# Altium schematic sheet Safety_2019_V_3_0_BSPD.SchDoc
size A
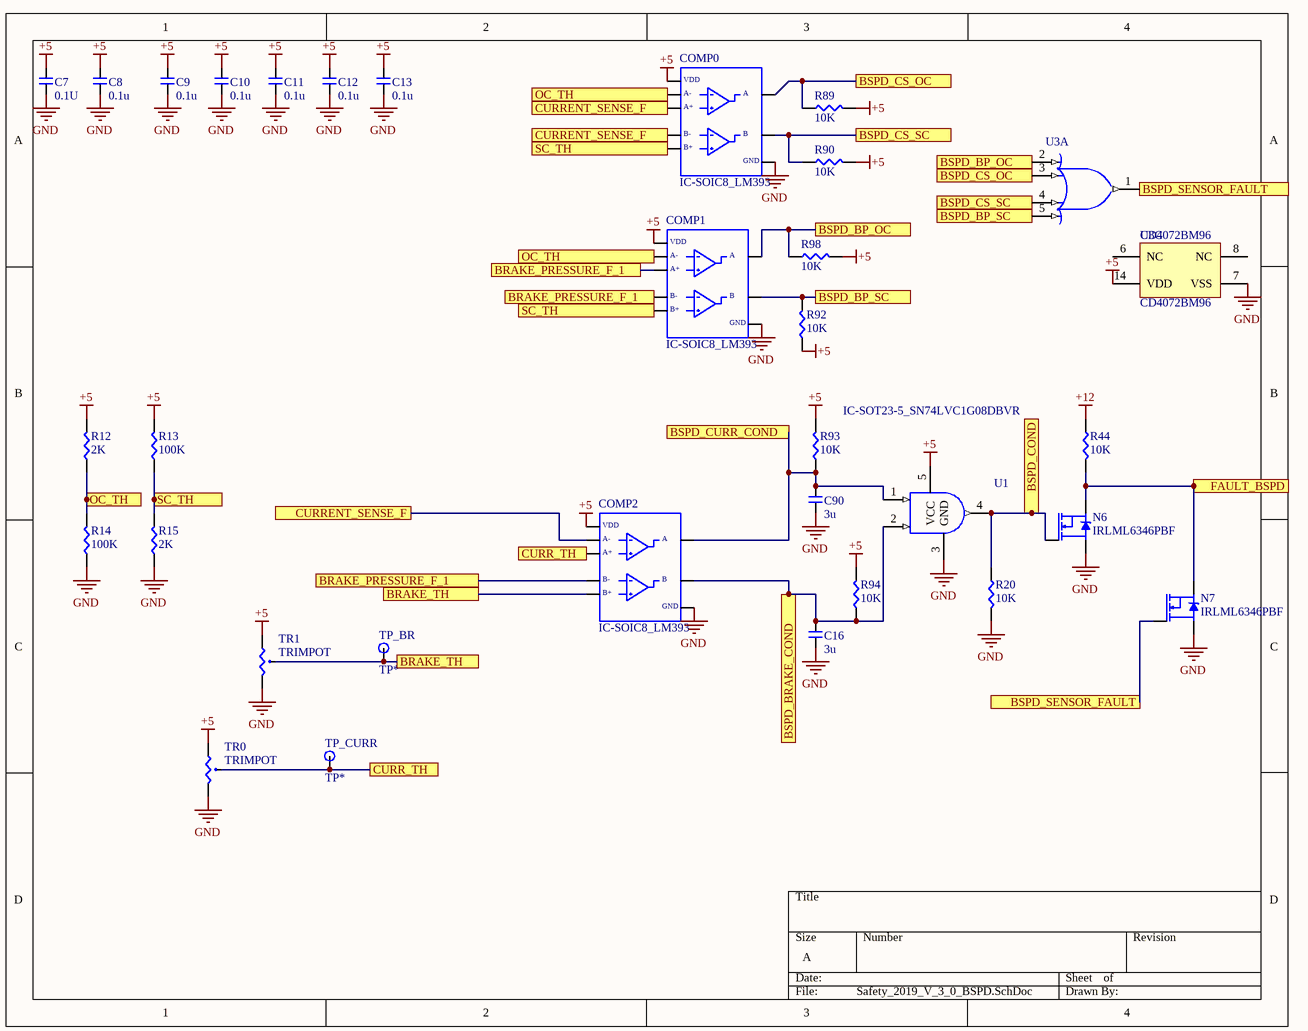
[diagram p0: Safety_2019_V_3_0_BSPD.SchDoc]

## Parts
C7  0.1U  [CAP-0603]
C8  0.1u  [CAP-0603]
C9  0.1u  [CAP-0603]
C10  0.1u  [CAP-0603]
C11  0.1u  [CAP-0603]
C12  0.1u  [CAP-0603]
C13  0.1u  [CAP-0603]
C16  3u  [CAP-0603]
C90  3u  [CAP-0603]
COMP0  IC-SOIC8_LM393  [SOIC8]
COMP1  IC-SOIC8_LM393  [SOIC8]
COMP2  IC-SOIC8_LM393  [SOIC8]
N6  IRLML6346PBF  [SOT23]
N7  IRLML6346PBF  [SOT23]
R12  2K  [RES-0603]
R13  100K  [RES-0603]
R14  100K  [RES-0603]
R15  2K  [RES-0603]
R20  10K  [RES-0603]
R44  10K  [RES-0603]
R89  10K  [RES-0603]
R90  10K  [RES-0603]
R92  10K  [RES-0603]
R93  10K  [RES-0603]
R94  10K  [RES-0603]
R98  10K  [RES-0603]
TP_BR  TP*  [Testpoint]
TP_CURR  TP*  [Testpoint]
TR0  TRIMPOT  [TRIMPOT_PV36W]
TR1  TRIMPOT  [TRIMPOT_PV36W]
U1  IC-SOT23-5_SN74LVC1G08DBVR  [SOT95P280X110-5N]
U3  CD4072BM96  [SOIC127P600X175-14N]  (parts A,C of 3)

## Ports
BRAKE_PRESSURE_F_1, BRAKE_TH, BSPD_BP_OC, BSPD_BP_SC, BSPD_BRAKE_COND, BSPD_COND, BSPD_CS_OC, BSPD_CS_SC, BSPD_CURR_COND, BSPD_SENSOR_FAULT, CURR_TH, CURRENT_SENSE_F, FAULT_BSPD, OC_TH, SC_TH

## Nets
+5: C7.2 C8.2 C9.2 C10.2 C11.2 C12.2 C13.2 COMP0.8 COMP1.8 COMP2.8 R12.2 R13.2 R89.2 R90.2 R92.1 R93.2 R94.2 R98.2 TR0.1 TR1.1 U1.5(VCC) U3.14(VDD)
+12: R44.1
GND: C7.1 C8.1 C9.1 C10.1 C11.1 C12.1 C13.1 C16.1 C90.1 COMP0.4 COMP1.4 COMP2.4 N6.2(S) N7.2(S) R14.1 R15.1 R20.2 TR0.3 TR1.3 U1.3(GND) U3.7(VSS)
BRAKE_PRESSURE_F_1: COMP1.3 COMP1.6 COMP2.6 ; port BRAKE_PRESSURE_F_1
BRAKE_TH: COMP2.5 TP_BR.1 TR1.2 ; port BRAKE_TH
BSPD_BP_OC: COMP1.1 R98.1 U3.2(A) ; port BSPD_BP_OC
BSPD_BP_SC: COMP1.7 R92.2 U3.5(D) ; port BSPD_BP_SC
BSPD_BRAKE_COND: C16.2 COMP2.7 R94.1 U1.2(B) ; port BSPD_BRAKE_COND
BSPD_COND: N6.1(G) R20.1 U1.4(Y) ; port BSPD_COND
BSPD_CS_OC: COMP0.1 R89.1 U3.3(B) ; port BSPD_CS_OC
BSPD_CS_SC: COMP0.7 R90.1 U3.4(C) ; port BSPD_CS_SC
BSPD_CURR_COND: C90.2 COMP2.1 R93.1 U1.1(A) ; port BSPD_CURR_COND
BSPD_SENSOR_FAULT: N7.1(G) U3.1(J) ; port BSPD_SENSOR_FAULT
CURR_TH: COMP2.3 TP_CURR.1 TR0.2 ; port CURR_TH
CURRENT_SENSE_F: COMP0.3 COMP0.6 COMP2.2 ; port CURRENT_SENSE_F
FAULT_BSPD: N6.3(D) N7.3(D) R44.2 ; port FAULT_BSPD
OC_TH: COMP0.2 COMP1.2 R12.1 R14.2 ; port OC_TH
SC_TH: COMP0.5 COMP1.5 R13.1 R15.2 ; port SC_TH

Not connected (* = marked no-connect by the designer): U3 6(NC) 8(NC)

## Notes on the sheet
- (in symbol IC-SOIC8_LM393) VDD; A-; A; A+; B-; B; B+; GND

## Library data of the parts
C7-C13 C16 C90 = CAP-0603
N6 N7 = NMOS-SOT23
R12-R15 R20 R44 R89 R90 R92-R94 R98 = RES-0603
TP_BR TP_CURR = Testpoint
TR0 TR1 = TRIMPOT_PV36W
U1 = IC-SOT23-5_SN74LVC1G08DBVR: IC GATE AND 1CH 2-INP SOT23-5; Manufacturer: Texas Instruments; Min Supply Voltage: 1.65V; Max Supply Voltage: 5.5V; Number of Inputs: 2; Propagation Delay: 4ns; Number of Circuits: 1; Quiescent Current: 10uA; High Level Output Current: -32mA; Low Level Output Current: 32mA; Turn-On Delay Time: 4.5ns; Supplier 1: Digi-Key; Manufacturer Part Number: SN74LVC1G08DBVR; Stock 1: 245825; Pricing 1: 1 = 0.43000, 10 = 0.32000, 100 = 0.19960, 500 = 0.13658, 1000 = 0.10506 (USD); RoHS: Yes; Mount: Surface Mount; Case/Package: SOT-23; Number of Pins: 5; Weight: 0.000557oz; Contact Plating: Gold; Min Operating Temperature: -40°C; Max Operating Temperature: 125°C; Packaging: Tape and Reel; Logic Function: AND; Package Quantity: 1; Number of Gates: 1; Number of Outputs: 1; Number of Input Lines: 2; Number of Elements: 1; Number of Output Lines: 1; Number of Bits: 1; Output Current: 32mA; Max Output Current: 32mA; Termination: SMD/SMT; Radiation Hardening: No; Lead Free: Lead Free; REACH SVHC: No SVHC; ComponentLink1URL: http://www.jameco.com/Jameco/Products/ProdDS/756490.pdf?src-supplier=Jameco; ComponentLink1Description: http://www.jameco.com/Jameco/Products/ProdDS/756490.pdf?src-supplier=Jameco; ComponentLink2URL: http://focus.ti.com/lit/ds/symlink/sn74lvc1g08.pdf?src-supplier=Avnet+Europe; ComponentLink2Description: http://focus.ti.com/lit/ds/symlink/sn74lvc1g08.pdf?src-supplier=Avnet+Europe; ComponentLink3URL: http://www.ti.com/general/docs/lit/getliterature.tsp?genericPartNumber=SN74LVC1G08&amp;&amp;fileType=pdf&src-supplier=Avnet+Asia; ComponentLink3Description: http://www.ti.com/general/docs/lit/getliterature.tsp?genericPartNumber=SN74LVC1G08&amp;&amp;fileType=pdf&src-supplier=Avnet+Asia; ComponentLink4URL: http://www.farnell.com/datasheets/1996458.pdf?src-supplier=Element14; ComponentLink4Description: http://www.farnell.com/datasheets/1996458.pdf?src-supplier=Element14; ComponentLink5URL: http://www.ti.com/lit/pdf/sdyu001?src-supplier=Digi-Key; ComponentLink5Description: http://www.ti.com/lit/pdf/sdyu001?src-supplier=Digi-Key; ComponentLink6URL: https://www.verical.com/server-webapp/html/getDatasheet?partID=39173&src-supplier=Verical; ComponentLink6Description: https://www.verical.com/server-webapp/html/getDatasheet?partID=39173&src-supplier=Verical; ComponentLink7URL: http://www.ti.com/general/docs/lit/getliterature.tsp?genericPartNumber=SN74LVC1G08&&fileType=pdf&src-supplier=Avnet; ComponentLink7Description: http://www.ti.com/general/docs/lit/getliterature.tsp?genericPartNumber=SN74LVC1G08&&fileType=pdf&src-supplier=Avnet; ComponentLink8URL: http://www.produktinfo.conrad.com/datenblaetter/1000000-1099999/001074511-da-01-en-IC_2_INPUT_SN74LVC1G08DBVR_SOT_23_5_TID.pdf?src-supplier=Conrad; ComponentLink8Description: http://www.produktinfo.conrad.com/datenblaetter/1000000-1099999/001074511-da-01-en-IC_2_INPUT_SN74LVC1G08DBVR_SOT_23_5_TID.pdf?src-supplier=Conrad
U3 = IC-SOIC14_CD4072BM96: Logic Gates CMOS Dual 4-Input OR; Manufacturer: Texas Instruments; Output Current: 6.8mA; Propagation Delay: 90ns; Max Supply Voltage: 18V; Min Supply Voltage: 3V; Number of Outputs: 1; Number of Inputs: 4; Number of Circuits: 2; Quiescent Current: 5uA; High Level Output Current: 3.4mA; Turn-On Delay Time: 120ns; Supplier 1: Digi-Key; Manufacturer Part Number: CD4072BM96; Stock 1: 5874; Pricing 1: 1 = 0.42000, 10 = 0.35900, 100 = 0.26820, 500 = 0.21074, 1000 = 0.16284 (USD); RoHS: Yes; Mount: Surface Mount; Case/Package: SOIC; Number of Pins: 14; Weight: 0.004564oz; Contact Plating: Gold; Min Operating Temperature: -55°C; Max Operating Temperature: 125°C; Packaging: Tape and Reel; Package Quantity: 1; Logic Function: OR; Low Level Output Current: 3.4mA; Number of Gates: 2; Number of Input Lines: 4; Number of Output Lines: 1; Number of Elements: 2; Number of Bits: 2; Lead Free: Lead Free; REACH SVHC: No SVHC; ComponentLink1URL: http://www.ti.com/general/docs/lit/getliterature.tsp?genericPartNumber=CD4072B-MIL&&fileType=pdf&src-supplier=Avnet; ComponentLink1Description: http://www.ti.com/general/docs/lit/getliterature.tsp?genericPartNumber=CD4072B-MIL&&fileType=pdf&src-supplier=Avnet; ComponentLink2URL: http://www.farnell.com/datasheets/1834701.pdf?src-supplier=Element14; ComponentLink2Description: http://www.farnell.com/datasheets/1834701.pdf?src-supplier=Element14; ComponentLink3URL: http://www.produktinfo.conrad.com/datenblaetter/1000000-1099999/001073543-da-01-en-IC_DUAL_4INPUT_OR_CD4072BM96_SOIC_14_TID.pdf?src-supplier=Conrad; ComponentLink3Description: http://www.produktinfo.conrad.com/datenblaetter/1000000-1099999/001073543-da-01-en-IC_DUAL_4INPUT_OR_CD4072BM96_SOIC_14_TID.pdf?src-supplier=Conrad